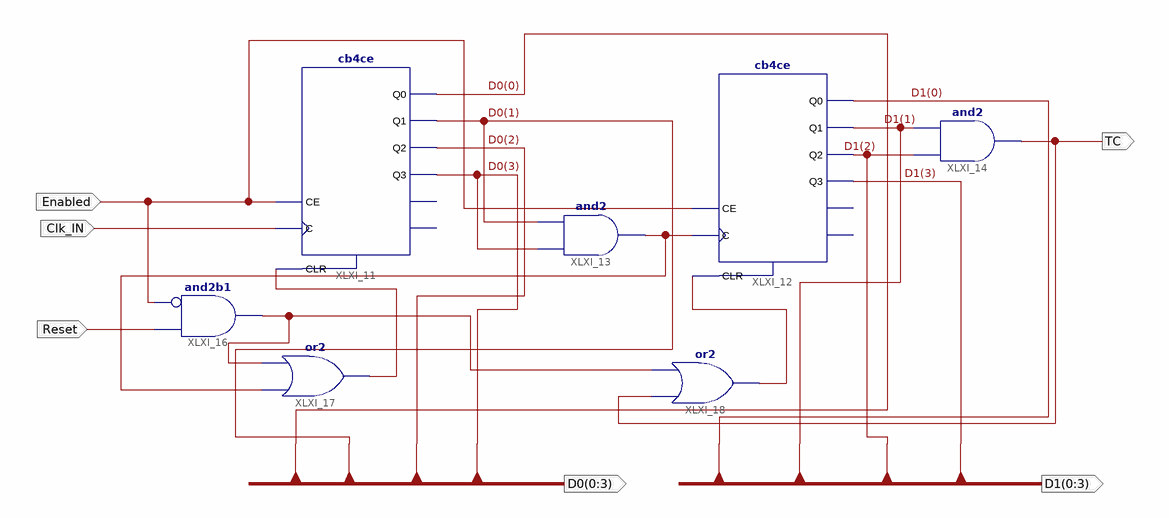
[diagram p0: schematic sheet 1]
// Xilinx ISE schematic SECONDDD.sch (spartan6) as structural Verilog: 7 symbols, 6 ports
module SECONDDD (
  input  Clk_IN,
  input  Enabled,
  input  Reset,
  output TC,
  output [0:3] D0,
  output [0:3] D1
);

  wire XLXN_49, XLXN_50, XLXN_51, XLXN_53;

  cb4ce XLXI_11 (
    .C(Clk_IN), .CE(Enabled), .CLR(XLXN_50), .Q0(D0[0]), .Q1(D0[1]), .Q2(D0[2]), .Q3(D0[3]));  // open: CEO, TC
  cb4ce XLXI_12 (
    .C(XLXN_51), .CE(Enabled), .CLR(XLXN_53), .Q0(D1[0]), .Q1(D1[1]), .Q2(D1[2]), .Q3(D1[3]));  // open: CEO, TC
  and XLXI_13 (XLXN_51, D0[3], D0[1]);
  and XLXI_14 (TC, D1[2], D1[1]);
  and XLXI_16 (XLXN_49, ~Enabled, Reset);  // and2b1
  or XLXI_17 (XLXN_50, XLXN_49, XLXN_51);
  or XLXI_18 (XLXN_53, XLXN_49, TC);
endmodule
